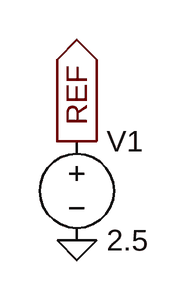
[diagram p0: schematic REF.asc]
REF.asc, the LTspice schematic file:
Version 4.1
SHEET 1 880 680
FLAG 192 208 0
FLAG 192 128 REF
IOPIN 192 128 Out
SYMBOL voltage 192 112 R0
WINDOW 123 0 0 Left 0
WINDOW 39 0 0 Left 0
SYMATTR InstName V1
SYMATTR Value 2.5

The netlist it stands for:
* REF.asc
V1 REF 0 2.5
.backanno
.end